# EAGLE design TeensyBurner (EAGLE 8.0.1)
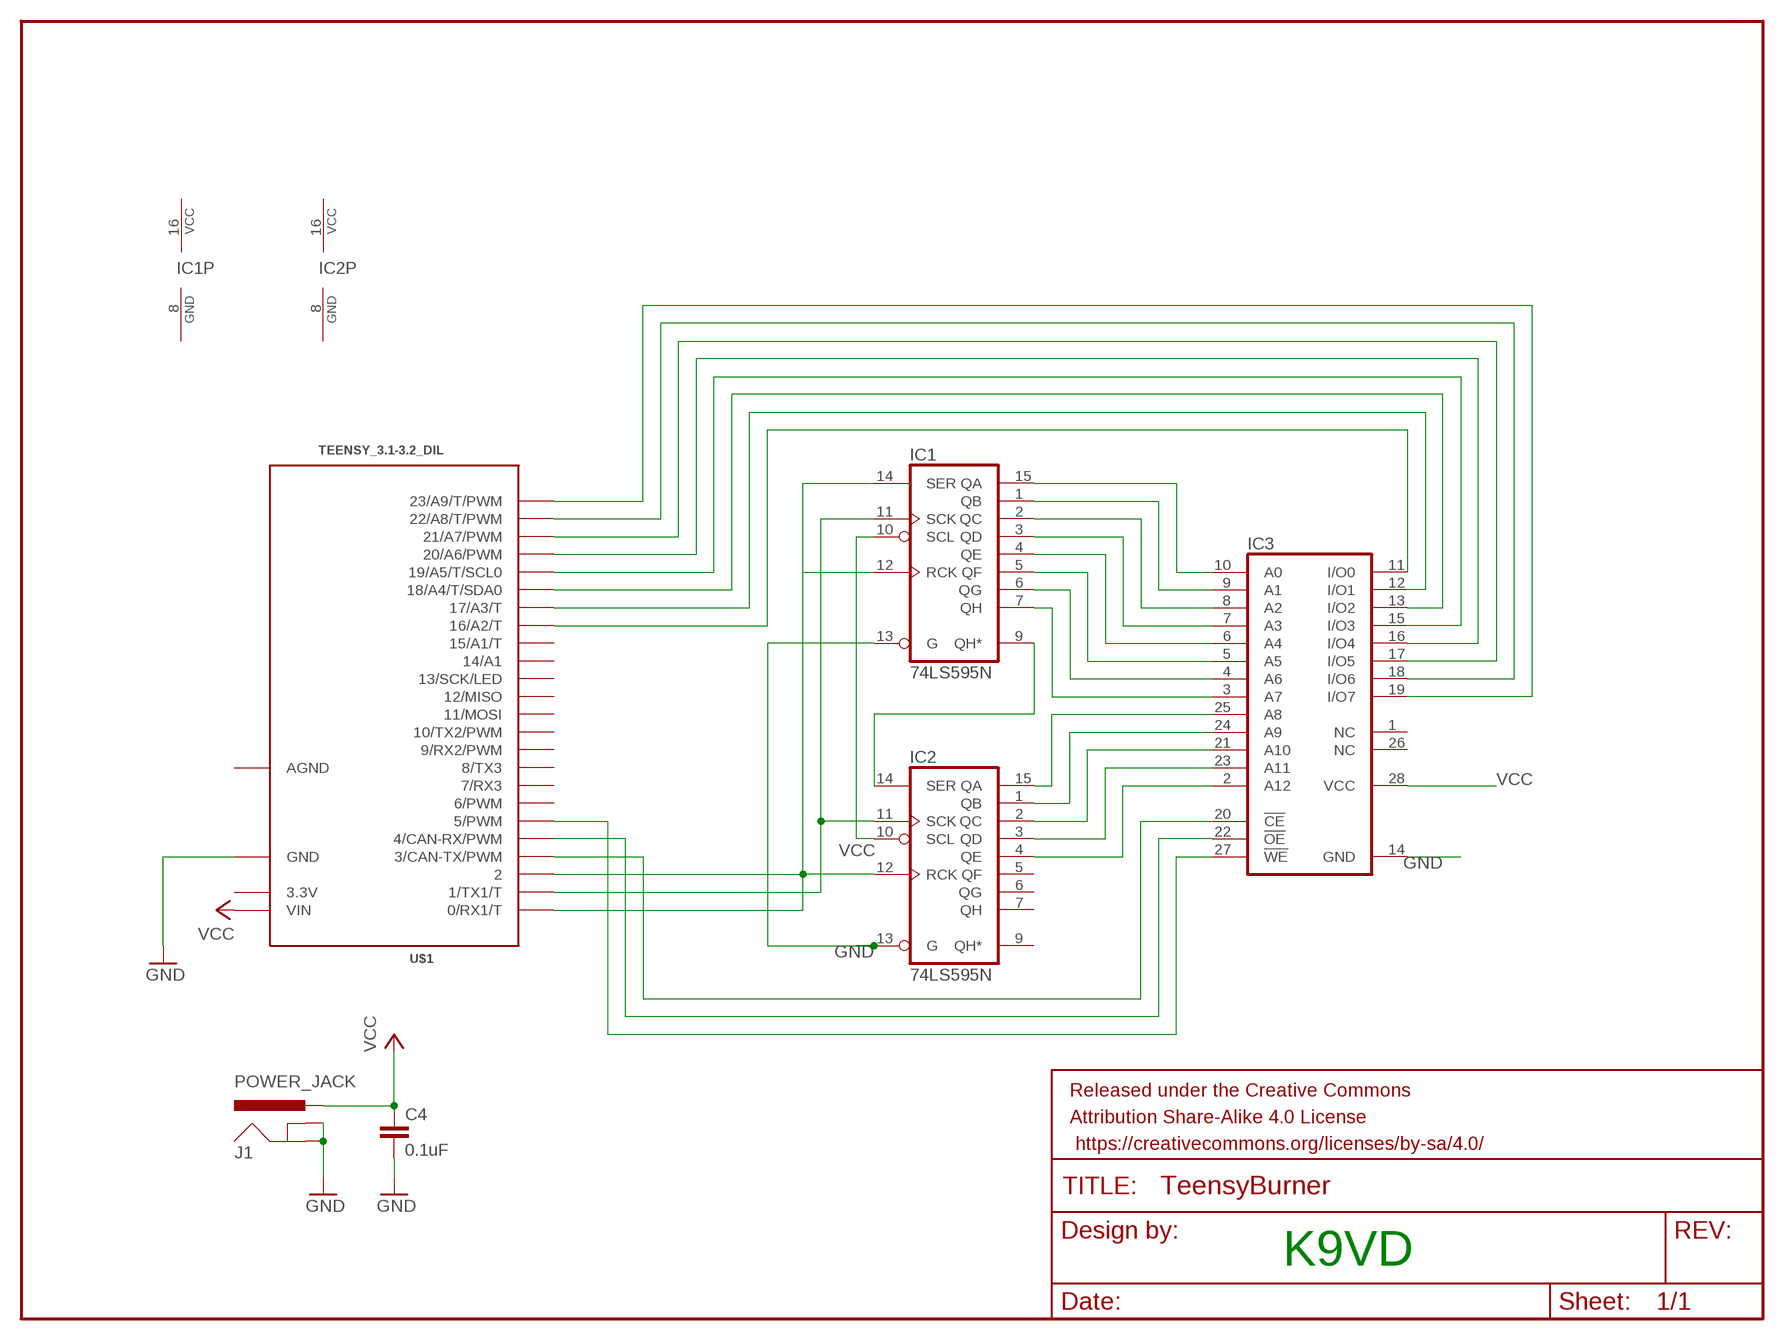
[diagram p0: schematic, sheet 1]

## Parts
C4  0.1uF  0.1UF-KIT-EZ-50V-20%  [CAP-PTH-SMALL-KIT]
FRAME1  FRAME-LETTERNO_PACKAGE  [DUMMY]
IC1  74LS595N  [DIL16]
IC2  74LS595N  [DIL16]
IC3  28C64C  [DIL28-6]
J1  POWER_JACK  [POWER_JACK_PTH]
U$1  TEENSY_3.1-3.2_DIL  [TEENSY_3.0-3.2&LC_DIL]

## Nets
GND: C4.2 IC1.13(G) IC2.13(G) IC3.14(GND) J1.GND J1.GNDBREAK U$1.GND
N$1: IC1.9(QH*) IC2.14(SER)
N$2: IC1.14(SER) U$1.0(0/RX1/T)
N$3: IC1.12(RCK) IC2.12(RCK) U$1.2
N$4: IC1.11(SCK) IC2.11(SCK) U$1.1(1/TX1/T)
N$5: IC1.15(QA) IC3.10(A0)
N$6: IC1.1(QB) IC3.9(A1)
N$7: IC1.2(QC) IC3.8(A2)
N$8: IC1.3(QD) IC3.7(A3)
N$9: IC1.4(QE) IC3.6(A4)
N$10: IC1.5(QF) IC3.5(A5)
N$11: IC1.6(QG) IC3.4(A6)
N$12: IC1.7(QH) IC3.3(A7)
N$13: IC2.15(QA) IC3.25(A8)
N$14: IC2.1(QB) IC3.24(A9)
N$15: IC2.2(QC) IC3.21(A10)
N$16: IC2.3(QD) IC3.23(A11)
N$17: IC2.4(QE) IC3.2(A12)
N$18: IC3.11(I/O0) U$1.16/A2(16/A2/T)
N$19: IC3.12(I/O1) U$1.17/A3(17/A3/T)
N$20: IC3.13(I/O2) U$1.18/A4(18/A4/T/SDA0)
N$21: IC3.15(I/O3) U$1.19/A5(19/A5/T/SCL0)
N$22: IC3.16(I/O4) U$1.20/A6(20/A6/PWM)
N$23: IC3.17(I/O5) U$1.21/A7(21/A7/PWM)
N$24: IC3.18(I/O6) U$1.22/A8(22/A8/T/PWM)
N$30: IC3.20(!CE) U$1.3(3/CAN-TX/PWM)
N$31: IC3.22(!OE) U$1.4(4/CAN-RX/PWM)
N$32: IC3.27(!WE) U$1.5(5/PWM)
N$36: IC3.19(I/O7) U$1.23/A9(23/A9/T/PWM)
VCC: C4.1 IC1.10(SCL) IC2.10(SCL) IC3.28(VCC) J1.PWR U$1.VIN
Unconnected: IC2.5(QF) IC2.6(QG) IC2.7(QH) IC2.9(QH*) IC3.1(NC) IC3.26(NC) U$1.6(6/PWM) U$1.7(7/RX3) U$1.8(8/TX3) U$1.9(9/RX2/PWM) U$1.10(10/TX2/PWM) U$1.11(11/MOSI) U$1.12(12/MISO) U$1.13(13/SCK/LED) U$1.14/A0(14/A1) U$1.15/A1(15/A1/T)

## Notes on the sheet
- K9VD

## Power pins joined to a net without a drawn wire
3.3V: U$1.3.3V
AGND: U$1.AGND
GND: IC1.8(GND) IC2.8(GND)
VCC: IC1.16(VCC) IC2.16(VCC)

## Library data of the parts
C4 = SparkFun-Capacitors:0.1UF: 0.1µF ceramic capacitors A capacitor is a passive two-terminal electrical component used to store electrical energy temporarily in an electric field.; PROD_ID: CAP-08370
FRAME1 = SparkFun-Aesthetics:FRAME-LETTER: Schematic Frame - Letter Standard 8.5x11 US Letter frame; DESIGNER: Nobody; VERSION: v01
IC1 IC2 = 74xx-us:74*595: 8-bit SHIFT REGISTER, output latch
IC3 = memory-nec:28C64C: MEMORY; MPN: AT28C64B-15PU; OC_FARNELL: 1095784; OC_NEWARK: 96K6557
J1 = SparkFun-Connectors:POWER_JACK: Power Jack Connector This is the standard 5.5mm barrel jack for power. The PTH is the most common, proven, reliable, footprint. The Slot footprint only works if the mill layer is transmitted to the PCB fab house so be warned. Here are the connectors we sell at SparkFun: DC Barrel Power Jack/Connector <https://www.sparkfun.com/products/119> (PRT-00119) DC Barrel Power Jack/Connector (SMD) <https://www.sparkfun.com/products/12748> (PRT-12748) DC Barrel Jack Adapter - Breadboard Compatible <https://www.sparkfun.com/products/10811> (PRT-10811) It is used on this SparkFun product (and many, many others): SparkFun RedBoard - Programmed with Arduino <https://www.sparkfun.com/products/12757> (DEV-12757) Also, if you need a mating power supply or connector, please check these out: Wall Adapter Power Supply - 9VDC 650mA <https://www.sparkfun.com/products/298> (TOL-00298) DC Barrel Jack Adapter - Male <https://www.sparkfun.com/products/10287> (PRT-10287); PROD_ID: CONN-08197
U$1 = Teensy_3_and_LC_Series_Boards_v1.4:TEENSY_3.1-3.2_DIL: Teensy 3.1 or 3.2 in a DIL Layout.

## Board
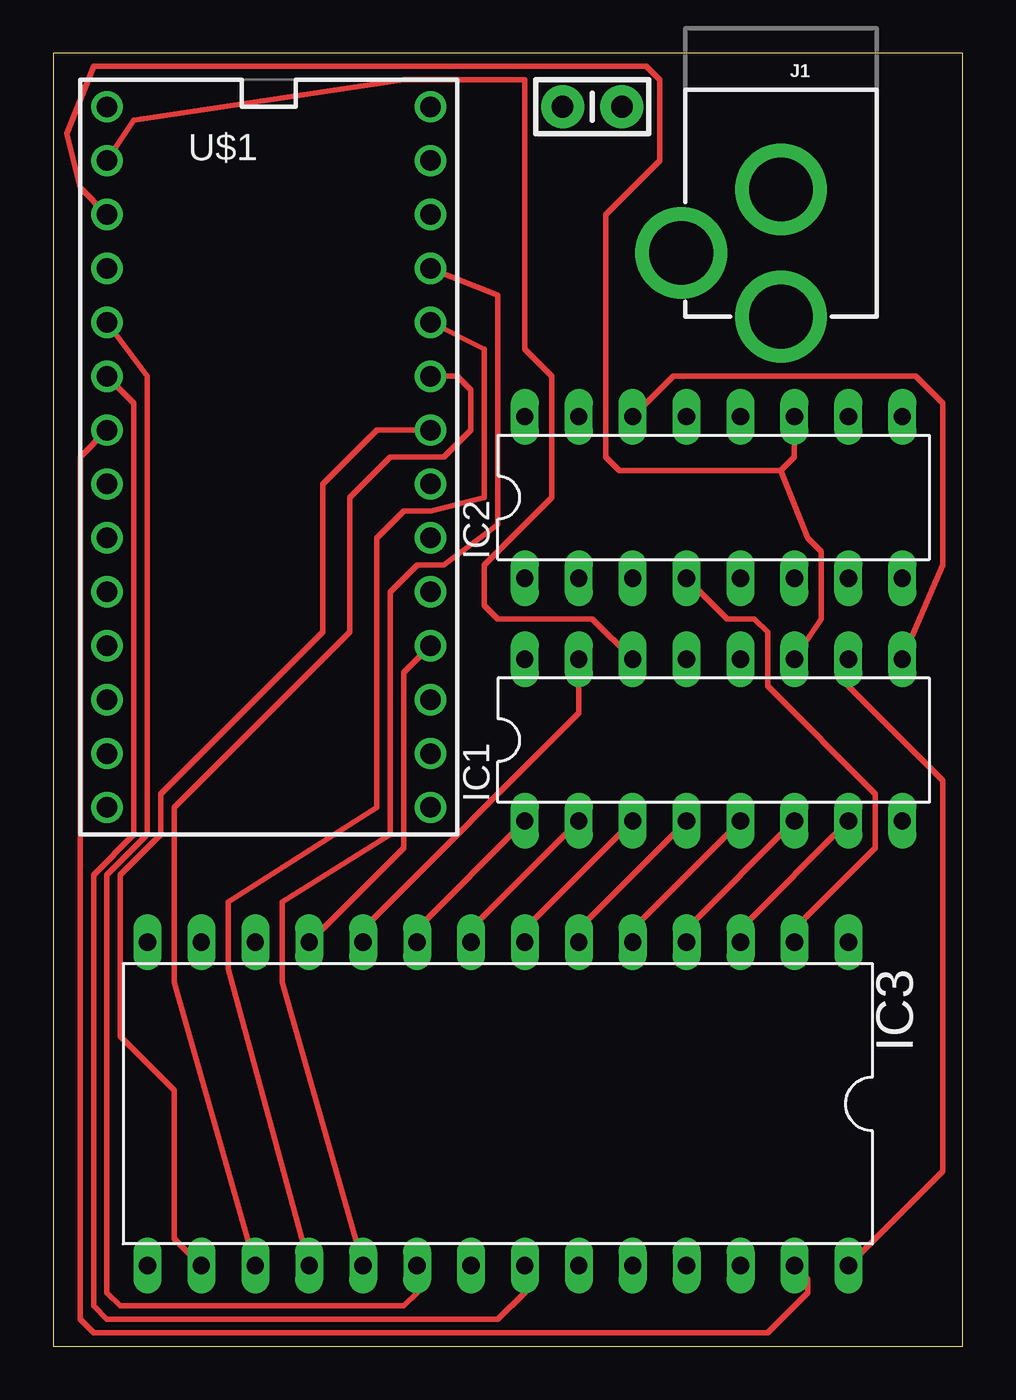
[diagram p1: board, top side]
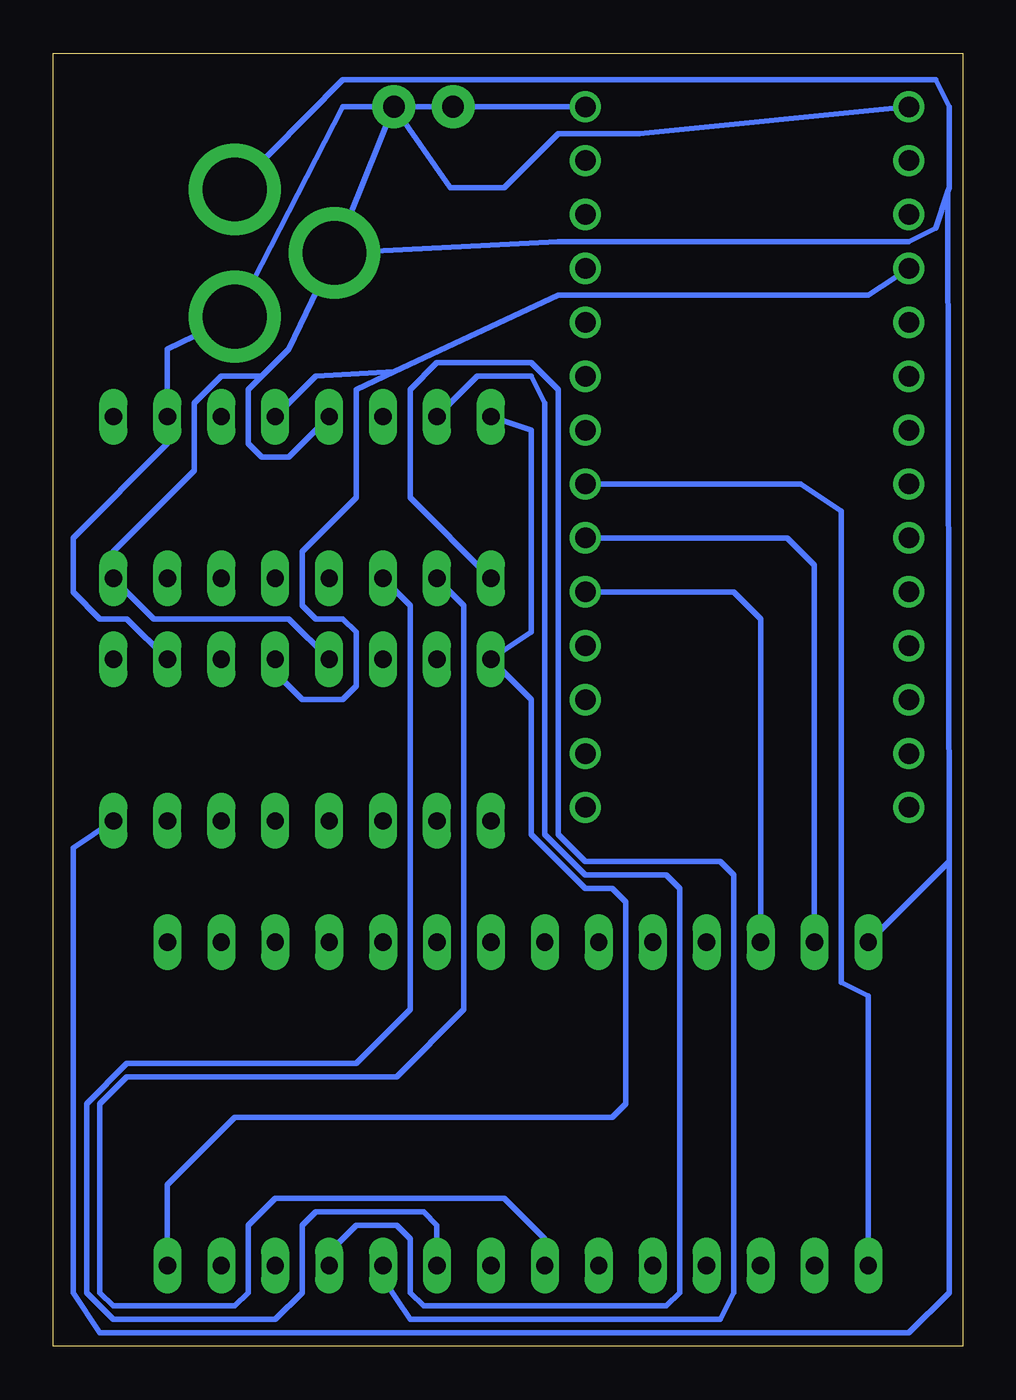
[diagram p2: board, bottom side, seen from below]

Size 42.85 x 60.95 mm. Coordinates in mm from the lower left corner, seen from the top.
Outline: 0,0 42.85,0 42.85,60.95 0,60.95 0,0
Copper layers (1*16): Top 0.035mm / dielectric 1.5mm / Bottom 0.035mm
Design rules "default": minimum track width 10mil, minimum drill 24mil, track to track 8mil, track to pad 8mil, pad to pad 8mil, via to via 8mil, smd to smd 8mil, copper to edge 40mil, drill to drill 8mil, minimum pad ring 10mil, minimum via ring 8mil, stop-mask expansion 4mil, vias tented up to drill 0mil, thermal gap 10mil

### Footprints (pad centres in the part's own frame; a part is rotated, then mirrored left to right if it is on the bottom)
CAP-PTH-SMALL-KIT = drill 1.016 pad 2.032: 1 -1.397,0; 2 1.397,0
DIL16 = drill 0.813 long: 1 -8.89,-3.81; 2 -6.35,-3.81; 3 -3.81,-3.81; 4 -1.27,-3.81; 5 1.27,-3.81; 6 3.81,-3.81; 7 6.35,-3.81; 8 8.89,-3.81; 9 8.89,3.81; 10 6.35,3.81; 11 3.81,3.81; 12 1.27,3.81; 13 -1.27,3.81; 14 -3.81,3.81; 15 -6.35,3.81; 16 -8.89,3.81
DIL28-6 = drill 0.813 long: 1 -16.51,-7.62; 2 -13.97,-7.62; 3 -11.43,-7.62; 4 -8.89,-7.62; 5 -6.35,-7.62; 6 -3.81,-7.62; 7 -1.27,-7.62; 8 1.27,-7.62; 9 3.81,-7.62; 10 6.35,-7.62; 11 8.89,-7.62; 12 11.43,-7.62; 13 13.97,-7.62; 14 16.51,-7.62; 15 16.51,7.62; 16 13.97,7.62; 17 11.43,7.62; 18 8.89,7.62; 19 6.35,7.62; 20 3.81,7.62; 21 1.27,7.62; 22 -1.27,7.62; 23 -3.81,7.62; 24 -6.35,7.62; 25 -8.89,7.62; 26 -11.43,7.62; 27 -13.97,7.62; 28 -16.51,7.62
POWER_JACK_PTH = drill 2.997 pad 4.318: GND 0,7.7; GNDBREAK 4.7,10.7; PWR 0,13.7
TEENSY_3.0-3.2&LC_DIL = drill 0.965: 0 -7.62,13.97; 1 -7.62,11.43; 2 -7.62,8.89; 3 -7.62,6.35; 3.3V 7.62,11.43; 4 -7.62,3.81; 5 -7.62,1.27; 6 -7.62,-1.27; 7 -7.62,-3.81; 8 -7.62,-6.35; 9 -7.62,-8.89; 10 -7.62,-11.43; 11 -7.62,-13.97; 12 -7.62,-16.51; 13 7.62,-16.51; 14/A0 7.62,-13.97; 15/A1 7.62,-11.43; 16/A2 7.62,-8.89; 17/A3 7.62,-6.35; 18/A4 7.62,-3.81; 19/A5 7.62,-1.27; 20/A6 7.62,1.27; 21/A7 7.62,3.81; 22/A8 7.62,6.35; 23/A9 7.62,8.89; AGND 7.62,13.97; GND -7.62,16.51; VIN 7.62,16.51

### Placement (x,y rotation side)
C4  25.4,58.42 0 top
FRAME1  -40.64,71.12 0 top  (outside the outline)
IC1  31.11,28.57 0 top
IC2  31.11,40.01 0 top
IC3  20.95,11.43 180 top
J1  34.29,62.23 180 top
U$1  10.16,41.91 0 top

### Tracks (layer width: path | path; a pad name or v marks a point on that pad's centre or on a via)
GND
  Bottom 0.254: U$1.GND 15.24,57.15 19.05,57.15 21.59,54.61 24.13,54.61 C4.2 J1.GNDBREAK | 29.84,33.02 IC1.13 31.75,34.29 38.1,34.29 IC2.8 40.01,37.47 36.2,41.27 36.2,44.45 34.92,45.72 33.02,45.72 | J1.GNDBREAK 19.05,52.07 2.54,52.07 1.27,52.7 0.7,54.42 | 0.7,54.42 0.64,54.61 0.64,58.42 1.27,59.69 29.21,59.69 J1.GND | IC3.14 0.64,22.86 | 0.64,22.86 0.7,54.42 | 0.64,22.86 0.64,2.54 2.54,0.64 40.64,0.64 41.91,2.54 41.91,23.5 IC1.8 | J1.GNDBREAK 31.75,46.99 33.02,45.72 | IC2.13 31.75,41.91 33.02,41.91 33.66,42.55 33.66,45.09 33.02,45.72
N$1
  Top 0.254: IC1.9 41.91,36.83 41.91,44.45 40.64,45.72 29.21,45.72 IC2.14
N$2
  Top 0.254: IC1.14 25.4,34.29 20.95,34.29 20.32,34.92 20.32,36.83 23.5,40.01 23.5,45.72 22.23,46.99 22.23,59.69 16.51,59.69 3.81,57.78 U$1.0
N$3
  Bottom 0.254: U$1.2 4.45,49.53 19.05,49.53 26.77,45.93 | 26.77,45.93 28.57,45.09 28.57,40.01 31.11,37.47 31.11,34.92 30.48,34.29 29.21,34.29 28.57,33.66 28.57,31.11 29.21,30.48 31.11,30.48 32.38,31.75 IC1.12 | 26.77,45.93 30.48,45.72 IC2.12
N$4
  Top 0.254: U$1.1 1.27,54.61 0.64,57.15 1.91,60.33 27.94,60.33 28.57,59.69 28.57,55.88 26.04,53.34 26.04,41.91 26.67,41.27 34.29,41.27 | IC2.11 34.92,41.91 34.29,41.27 | IC1.11 36.2,34.29 36.2,37.47 35.56,38.1 34.29,41.27
N$5
  Top 0.254: IC3.10 14.61,19.68 24.77,29.84 IC1.15
N$6
  Top 0.254: IC3.9 17.14,19.68 IC1.1
N$7
  Top 0.254: IC3.8 19.68,19.68 IC1.2
N$8
  Top 0.254: IC3.7 22.23,19.68 IC1.3
N$9
  Top 0.254: IC3.6 24.77,19.68 IC1.4
N$10
  Top 0.254: IC3.5 27.3,19.68 IC1.5
N$11
  Top 0.254: IC3.4 29.84,19.68 IC1.6
N$12
  Top 0.254: IC3.3 32.38,19.68 IC1.7
N$13
  Bottom 0.254: IC2.15 22.86,45.72 20.32,45.72 19.68,44.45 19.68,24.13 17.78,22.23 13.97,22.23 13.34,21.59 13.34,2.54 13.97,1.91 25.4,1.91 26.04,2.54 26.04,5.08 26.67,5.71 28.57,5.71 29.84,4.45 IC3.25
N$14
  Bottom 0.254: IC2.1 26.04,40.01 26.04,45.09 24.77,46.35 20.32,46.35 19.05,45.09 19.05,24.13 17.78,22.86 11.43,22.86 10.79,22.23 10.79,2.54 11.43,1.27 26.04,1.27 27.3,3.17 IC3.24
N$15
  Bottom 0.254: IC2.2 23.5,34.92 23.5,15.88 26.67,12.7 38.1,12.7 39.37,12.7 40.64,11.43 40.64,3.17 40.64,2.54 40.01,1.91 34.92,1.91 34.29,1.91 33.66,2.54 33.66,5.71 32.38,6.99 21.59,6.99 19.68,5.08 IC3.21
N$16
  Bottom 0.254: IC2.3 26.04,34.92 26.04,34.29 26.04,15.88 28.57,13.34 39.37,13.34 41.27,11.43 | 40.96,11.75 41.27,11.43 | 41.27,11.43 41.27,2.54 40.01,1.27 32.38,1.27 31.11,2.54 31.11,5.71 30.48,6.35 29.84,6.35 26.67,6.35 | 26.67,6.35 26.04,6.35 | 26.67,6.35 25.4,6.35 24.77,5.71 IC3.23
N$17
  Top 0.254: IC3.2 34.92,19.68 38.73,23.5 38.73,26.04 33.66,31.11 33.66,33.66 33.02,34.29 31.75,34.29 IC2.4
N$18
  Top 0.254: U$1.16/A2 16.51,31.75 16.51,23.5 IC3.11
N$19
  Bottom 0.254: IC3.12 9.53,34.29 10.79,35.56 U$1.17/A3
N$20
  Bottom 0.254: IC3.13 6.99,36.83 8.26,38.1 U$1.18/A4
N$21
  Bottom 0.254: IC3.15 4.45,16.51 5.71,17.14 5.71,39.37 7.62,40.64 U$1.19/A5
N$22
  Top 0.254: IC3.16 5.71,5.08 5.71,12.06 3.17,14.61 3.17,22.23 5.08,24.13 5.08,26.04 12.7,33.66 12.7,40.64 15.24,43.18 U$1.20/A6
N$23
  Top 0.254: IC3.17 5.71,17.14 5.71,25.4 13.97,33.66 13.97,40.01 15.88,41.91 18.41,41.91 19.05,42.55 19.68,43.18 19.68,45.09 19.05,45.72 U$1.21/A7
N$24
  Top 0.254: IC3.18 8.26,17.78 8.26,20.95 15.24,25.4 15.24,38.1 16.51,39.37 17.78,39.37 20.32,40.01 20.32,46.99 U$1.22/A8
N$30
  Top 0.254: U$1.3 4.45,45.72 4.45,24.13 2.54,22.23 2.54,2.54 3.17,1.91 16.51,1.91 17.14,2.54 IC3.20
N$31
  Top 0.254: U$1.4 3.81,44.45 3.81,24.13 1.91,22.23 1.91,1.91 2.54,1.27 20.95,1.27 22.23,2.54 IC3.22
N$32
  Top 0.254: IC3.27 35.56,3.17 35.56,2.54 33.66,0.64 1.91,0.64 1.27,1.27 1.27,41.91 U$1.5
N$36
  Top 0.254: U$1.23/A9 20.95,49.53 20.95,38.73 18.41,36.83 17.14,36.83 15.88,35.56 15.88,24.13 10.79,20.95 10.79,17.14 IC3.19
VCC
  Top 0.254: IC3.28 41.91,8.26 41.91,26.67 37.47,31.11 IC1.10
  Bottom 0.254: U$1.VIN C4.1 29.21,58.42 J1.PWR 37.47,46.99 IC2.10 37.47,42.55 41.91,38.1 41.91,35.56 40.64,34.29 39.37,34.29 IC1.10 | IC2.16 20.32,43.18 20.32,33.66 IC1.16 20.32,30.48 20.32,24.13 17.78,21.59 16.51,21.59 15.88,20.95 15.88,11.43 16.51,10.79 34.29,10.79 37.47,7.62 IC3.28